# Altium schematic sheet xc7z015unit3.SchDoc
size 297 x 209 mm
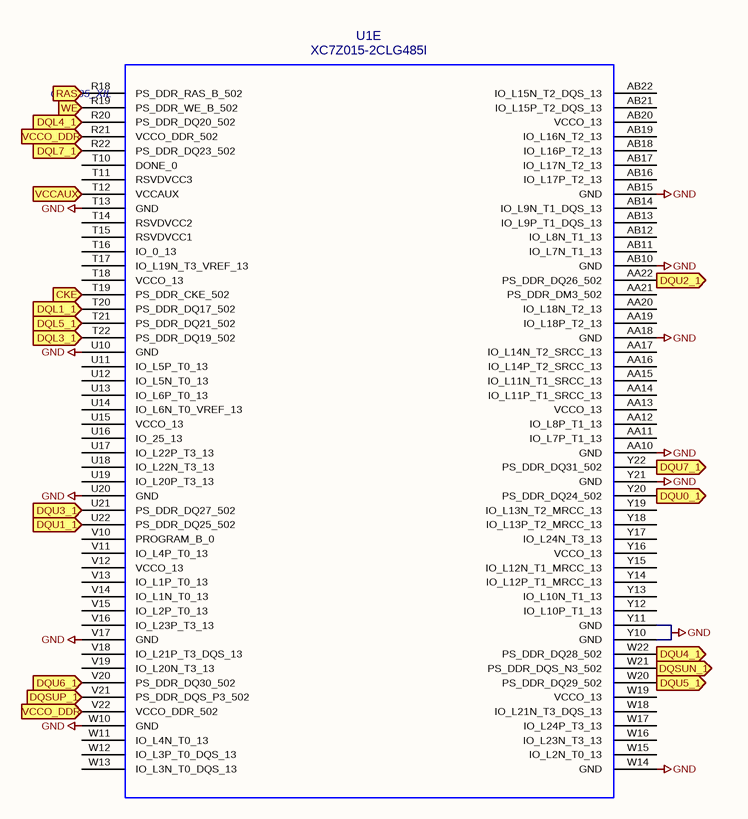
[diagram p0: xc7z015unit3.SchDoc]

## Parts
U1  XC7Z015-2CLG485I  [CLG485_XIL]  (part E of 5)

## Ports
CKE (in), DQL1_1 (in), DQL3_1 (in), DQL4_1 (in), DQL5_1 (in), DQL7_1 (in), DQSUN_1 (in), DQSUP_1 (in), DQU0_1 (in), DQU1_1 (in), DQU2_1 (in), DQU3_1 (in), DQU4_1 (in), DQU5_1 (in), DQU6_1 (in), DQU7_1 (in), RAS (in), VCCAUX (in), VCCO_DDR (in), WE (in)

## Nets
GND: U1.AA10(GND) U1.AA18(GND) U1.AB10(GND) U1.AB15(GND) U1.T13(GND) U1.U10(GND) U1.U20(GND) U1.V17(GND) U1.W10(GND) U1.W14(GND) U1.Y10(GND) U1.Y11(GND) U1.Y21(GND)
CKE: U1.T19(PS_DDR_CKE_502) ; port CKE
DQL1_1: U1.T20(PS_DDR_DQ17_502) ; port DQL1_1
DQL3_1: U1.T22(PS_DDR_DQ19_502) ; port DQL3_1
DQL4_1: U1.R20(PS_DDR_DQ20_502) ; port DQL4_1
DQL5_1: U1.T21(PS_DDR_DQ21_502) ; port DQL5_1
DQL7_1: U1.R22(PS_DDR_DQ23_502) ; port DQL7_1
DQSUN_1: U1.W21(PS_DDR_DQS_N3_502) ; port DQSUN_1
DQSUP_1: U1.V21(PS_DDR_DQS_P3_502) ; port DQSUP_1
DQU0_1: U1.Y20(PS_DDR_DQ24_502) ; port DQU0_1
DQU1_1: U1.U22(PS_DDR_DQ25_502) ; port DQU1_1
DQU2_1: U1.AA22(PS_DDR_DQ26_502) ; port DQU2_1
DQU3_1: U1.U21(PS_DDR_DQ27_502) ; port DQU3_1
DQU4_1: U1.W22(PS_DDR_DQ28_502) ; port DQU4_1
DQU5_1: U1.W20(PS_DDR_DQ29_502) ; port DQU5_1
DQU6_1: U1.V20(PS_DDR_DQ30_502) ; port DQU6_1
DQU7_1: U1.Y22(PS_DDR_DQ31_502) ; port DQU7_1
RAS: U1.R18(PS_DDR_RAS_B_502) ; port RAS
VCCAUX: U1.T12(VCCAUX) ; port VCCAUX
VCCO_DDR: U1.R21(VCCO_DDR_502) U1.V22(VCCO_DDR_502) ; port VCCO_DDR
WE: U1.R19(PS_DDR_WE_B_502) ; port WE

Not connected (* = marked no-connect by the designer): U1 AA11(IO_L7P_T1_13) AA12(IO_L8P_T1_13) AA13(VCCO_13) AA14(IO_L11P_T1_SRCC_13) AA15(IO_L11N_T1_SRCC_13) AA16(IO_L14P_T2_SRCC_13) AA17(IO_L14N_T2_SRCC_13) AA19(IO_L18P_T2_13) AA20(IO_L18N_T2_13) AA21(PS_DDR_DM3_502) AB11(IO_L7N_T1_13) AB12(IO_L8N_T1_13) AB13(IO_L9P_T1_DQS_13) AB14(IO_L9N_T1_DQS_13) AB16(IO_L17P_T2_13) AB17(IO_L17N_T2_13) AB18(IO_L16P_T2_13) AB19(IO_L16N_T2_13) AB20(VCCO_13) AB21(IO_L15P_T2_DQS_13) AB22(IO_L15N_T2_DQS_13) T10(DONE_0) T11(RSVDVCC3) T14(RSVDVCC2) T15(RSVDVCC1) T16(IO_0_13) T17(IO_L19N_T3_VREF_13) T18(VCCO_13) U11(IO_L5P_T0_13) U12(IO_L5N_T0_13) U13(IO_L6P_T0_13) U14(IO_L6N_T0_VREF_13) U15(VCCO_13) U16(IO_25_13) U17(IO_L22P_T3_13) U18(IO_L22N_T3_13) U19(IO_L20P_T3_13) V10(PROGRAM_B_0) V11(IO_L4P_T0_13) V12(VCCO_13) V13(IO_L1P_T0_13) V14(IO_L1N_T0_13) V15(IO_L2P_T0_13) V16(IO_L23P_T3_13) V18(IO_L21P_T3_DQS_13) V19(IO_L20N_T3_13) W11(IO_L4N_T0_13) W12(IO_L3P_T0_DQS_13) W13(IO_L3N_T0_DQS_13) W15(IO_L2N_T0_13) W16(IO_L23N_T3_13) W17(IO_L24P_T3_13) W18(IO_L21N_T3_DQS_13) W19(VCCO_13) Y12(IO_L10P_T1_13) Y13(IO_L10N_T1_13) Y14(IO_L12P_T1_MRCC_13) Y15(IO_L12N_T1_MRCC_13) Y16(VCCO_13) Y17(IO_L24N_T3_13) Y18(IO_L13P_T2_MRCC_13) Y19(IO_L13N_T2_MRCC_13)

## Notes on the sheet
- 1
- 2
- 3
- 4
- 5
- 6
- A
- B
- C
- D
- Title:
- File: xc7z015unit3.kicad_sch
- Sheet: /
- KiCad E.D.A.  kicad (5.1.4)-1
- Size: A4
- Date:
- Rev:
- Id: 1/1

## Library data of the parts
U1 = XC7Z015-2CLG485I: Value: XC7Z015-2CLG485I